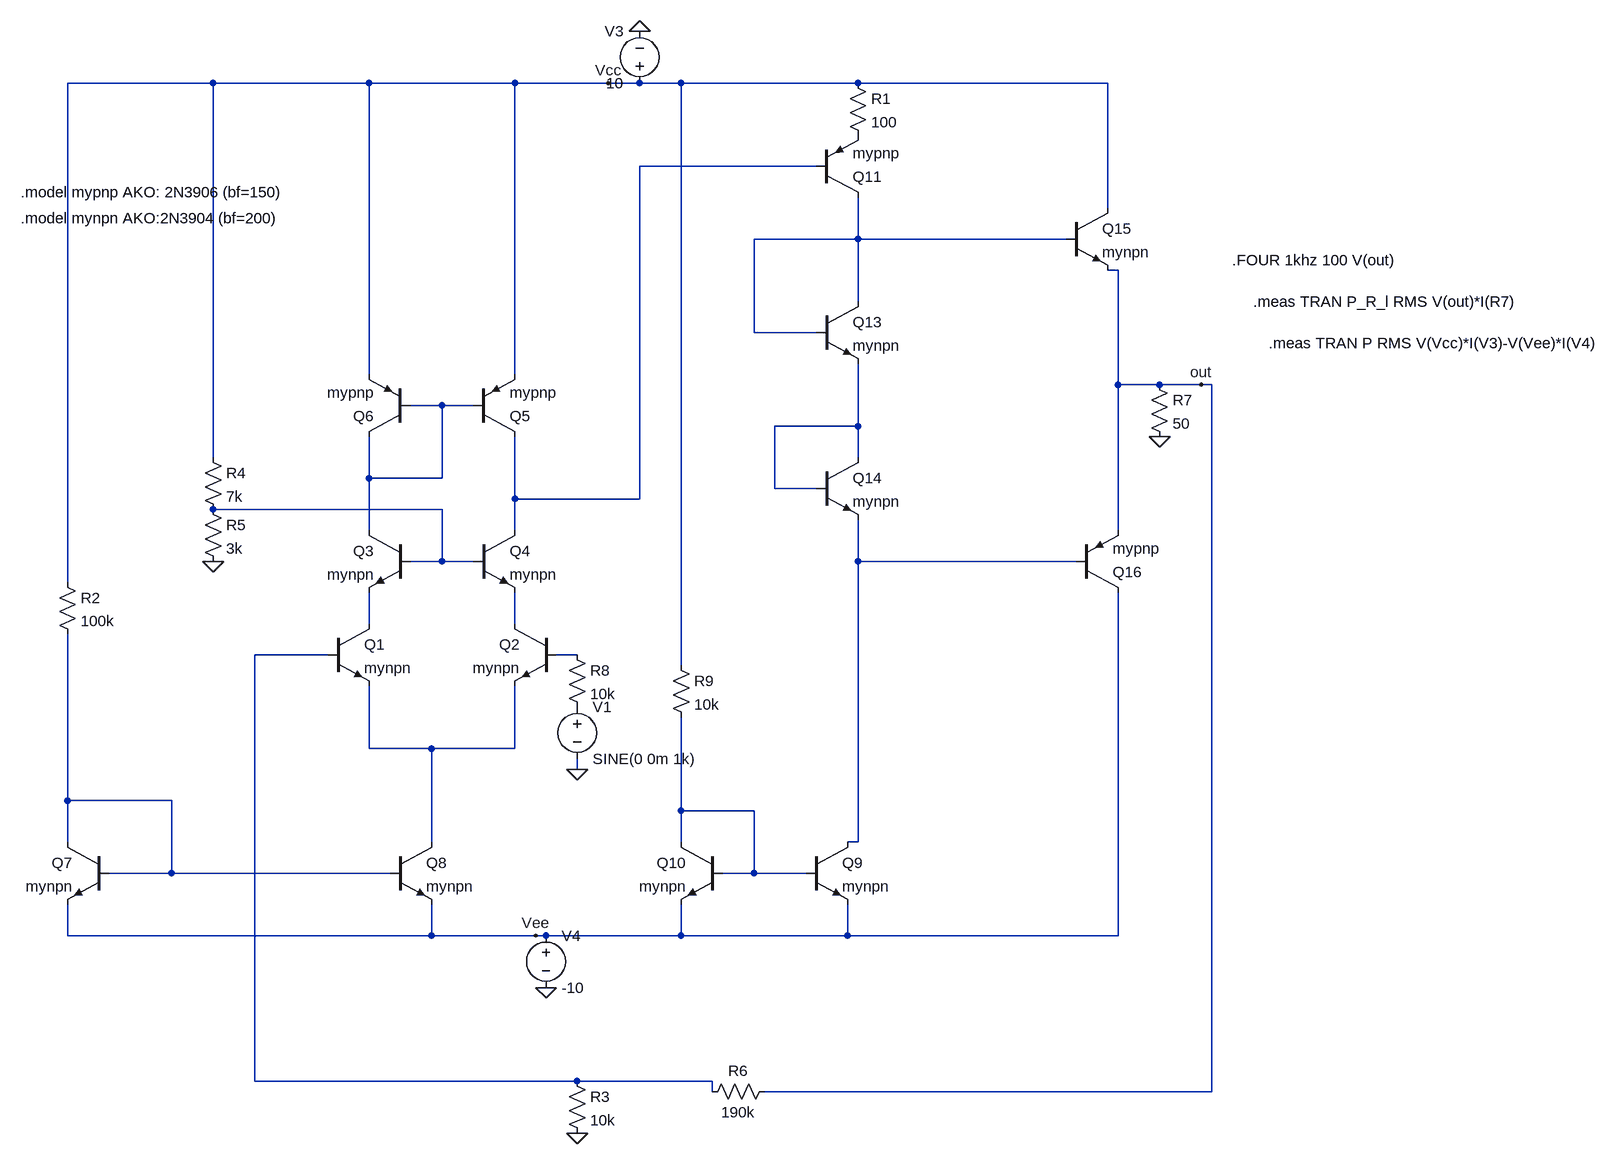
[diagram p0: schematic final_amplifier.asc]
final_amplifier.asc, the LTspice schematic file:
Version 4
SHEET 1 2220 936
WIRE -64 -720 -288 -720
WIRE 176 -720 -64 -720
WIRE 400 -720 176 -720
WIRE 544 -720 400 -720
WIRE 592 -720 544 -720
WIRE 656 -720 592 -720
WIRE 928 -720 656 -720
WIRE 1312 -720 928 -720
WIRE 864 -592 592 -592
WIRE 1312 -528 1312 -720
WIRE 928 -480 928 -544
WIRE 928 -480 768 -480
WIRE 1248 -480 928 -480
WIRE 1328 -432 1312 -432
WIRE 928 -384 928 -480
WIRE 768 -336 768 -480
WIRE 864 -336 768 -336
WIRE 176 -272 176 -720
WIRE 400 -272 400 -720
WIRE 1328 -256 1328 -432
WIRE 1392 -256 1328 -256
WIRE 1456 -256 1392 -256
WIRE 1472 -256 1456 -256
WIRE 288 -224 240 -224
WIRE 336 -224 288 -224
WIRE 928 -192 928 -288
WIRE 928 -192 800 -192
WIRE -64 -144 -64 -720
WIRE 928 -144 928 -192
WIRE 176 -112 176 -176
WIRE 288 -112 288 -224
WIRE 288 -112 176 -112
WIRE 800 -96 800 -192
WIRE 864 -96 800 -96
WIRE 400 -80 400 -176
WIRE 592 -80 592 -592
WIRE 592 -80 400 -80
WIRE 288 -64 -64 -64
WIRE 176 -32 176 -112
WIRE 400 -32 400 -80
WIRE 1328 -32 1328 -256
WIRE 288 16 288 -64
WIRE 288 16 240 16
WIRE 336 16 288 16
WIRE 928 16 928 -48
WIRE 1264 16 928 16
WIRE -288 48 -288 -720
WIRE 176 112 176 64
WIRE 400 112 400 64
WIRE 112 160 0 160
WIRE 496 160 464 160
WIRE 656 176 656 -720
WIRE 176 304 176 208
WIRE 272 304 176 304
WIRE 400 304 400 208
WIRE 400 304 272 304
WIRE 496 336 496 320
WIRE -288 384 -288 128
WIRE -128 384 -288 384
WIRE 656 400 656 256
WIRE 768 400 656 400
WIRE -288 448 -288 384
WIRE 272 448 272 304
WIRE 656 448 656 400
WIRE 928 448 928 16
WIRE 928 448 912 448
WIRE -128 496 -128 384
WIRE -128 496 -224 496
WIRE 208 496 -128 496
WIRE 768 496 768 400
WIRE 768 496 720 496
WIRE 848 496 768 496
WIRE -288 592 -288 544
WIRE 272 592 272 544
WIRE 272 592 -288 592
WIRE 432 592 272 592
WIRE 448 592 432 592
WIRE 656 592 656 544
WIRE 656 592 448 592
WIRE 912 592 912 544
WIRE 912 592 656 592
WIRE 1328 592 1328 64
WIRE 1328 592 912 592
WIRE 0 816 0 160
WIRE 496 816 0 816
WIRE 704 816 496 816
WIRE 704 832 704 816
WIRE 1472 832 1472 -256
WIRE 1472 832 784 832
FLAG -64 16 0
FLAG 496 336 0
FLAG 1456 -256 out
FLAG 544 -720 Vcc
FLAG 432 592 Vee
FLAG 592 -800 0
FLAG 448 672 0
FLAG 496 896 0
FLAG 1392 -176 0
SYMBOL npn 112 112 R0
SYMATTR InstName Q1
SYMATTR Value mynpn
SYMBOL npn 464 112 M0
SYMATTR InstName Q2
SYMATTR Value mynpn
SYMBOL npn 240 -32 M0
SYMATTR InstName Q3
SYMATTR Value mynpn
SYMBOL npn 336 -32 R0
SYMATTR InstName Q4
SYMATTR Value mynpn
SYMBOL pnp 336 -176 M180
SYMATTR InstName Q5
SYMATTR Value mypnp
SYMBOL pnp 240 -176 R180
SYMATTR InstName Q6
SYMATTR Value mypnp
SYMBOL npn 208 448 R0
SYMATTR InstName Q8
SYMATTR Value mynpn
SYMBOL npn -224 448 M0
SYMATTR InstName Q7
SYMATTR Value mynpn
SYMBOL res -304 32 R0
SYMATTR InstName R2
SYMATTR Value 100k
SYMBOL res -80 -160 R0
SYMATTR InstName R4
SYMATTR Value 7k
SYMBOL res -80 -80 R0
SYMATTR InstName R5
SYMATTR Value 3k
SYMBOL npn 864 -384 R0
SYMATTR InstName Q13
SYMATTR Value mynpn
SYMBOL npn 864 -144 R0
SYMATTR InstName Q14
SYMATTR Value mynpn
SYMBOL npn 1248 -528 R0
SYMATTR InstName Q15
SYMATTR Value mynpn
SYMBOL pnp 864 -544 M180
SYMATTR InstName Q11
SYMATTR Value mypnp
SYMBOL pnp 1264 64 M180
SYMATTR InstName Q16
SYMATTR Value mypnp
SYMBOL npn 848 448 R0
SYMATTR InstName Q9
SYMATTR Value mynpn
SYMBOL res 912 -736 R0
SYMATTR InstName R1
SYMATTR Value 100
SYMBOL res 480 144 R0
SYMATTR InstName R8
SYMATTR Value 10k
SYMBOL npn 720 448 M0
SYMATTR InstName Q10
SYMATTR Value mynpn
SYMBOL res 640 160 R0
SYMATTR InstName R9
SYMATTR Value 10k
SYMBOL voltage 448 576 R0
SYMATTR InstName V4
SYMATTR Value -10
SYMBOL voltage 592 -704 R180
WINDOW 0 24 96 Left 2
WINDOW 3 24 16 Left 2
SYMATTR InstName V3
SYMATTR Value 10
SYMBOL res 480 800 R0
SYMATTR InstName R3
SYMATTR Value 10k
SYMBOL res 800 816 R90
WINDOW 0 0 56 VBottom 2
WINDOW 3 32 56 VTop 2
SYMATTR InstName R6
SYMATTR Value 190k
SYMBOL res 1376 -272 R0
SYMATTR InstName R7
SYMATTR Value 50
SYMBOL voltage 496 224 R0
WINDOW 123 0 0 Left 0
WINDOW 39 0 0 Left 0
SYMATTR InstName V1
SYMATTR Value SINE(0 0m 1k)
TEXT -360 -552 Left 2 !.model mypnp AKO: 2N3906 (bf=150)
TEXT -360 -512 Left 2 !.model mynpn AKO:2N3904 (bf=200)
TEXT 1536 -384 Left 2 !.meas TRAN P_R_l RMS V(out)*I(R7)
TEXT 1560 -320 Left 2 !.meas TRAN P RMS V(Vcc)*I(V3)-V(Vee)*I(V4)
TEXT 1504 -448 Left 2 !.FOUR 1khz 100 V(out)

The netlist it stands for:
* final_amplifier.asc
Q1 N007 N009 N011 0 mynpn
Q2 N008 N010 N011 0 mynpn
Q3 N003 N005 N007 0 mynpn
Q4 N001 N005 N008 0 mynpn
Q5 N001 N003 Vcc 0 mypnp
Q6 N003 N003 Vcc 0 mypnp
Q8 N011 N012 Vee 0 mynpn
Q7 N012 N012 Vee 0 mynpn
R2 Vcc N012 100k
R4 Vcc N005 7k
R5 N005 0 3k
Q13 N002 N002 N004 0 mynpn
Q14 N004 N004 N006 0 mynpn
Q15 Vcc N002 out 0 mynpn
Q11 N002 N001 P001 0 mypnp
Q16 Vee N006 out 0 mypnp
Q9 N006 N013 Vee 0 mynpn
R1 Vcc P001 100
R8 N010 P002 10k
Q10 N013 N013 Vee 0 mynpn
R9 Vcc N013 10k
V4 Vee 0 -10
V3 Vcc 0 10
R3 N009 0 10k
R6 out N009 190k
R7 out 0 50
V1 P002 0 SINE(0 0m 1k)
.model NPN NPN
.model PNP PNP
.lib standard.bjt
.model mypnp AKO: 2N3906 (bf=150)
.model mynpn AKO:2N3904 (bf=200)
.meas TRAN P_R_l RMS V(out)*I(R7)
.meas TRAN P RMS V(Vcc)*I(V3)-V(Vee)*I(V4)
.FOUR 1khz 100 V(out)
.backanno
.end